# Altium schematic sheet NB-IOT.SchDoc
size A4
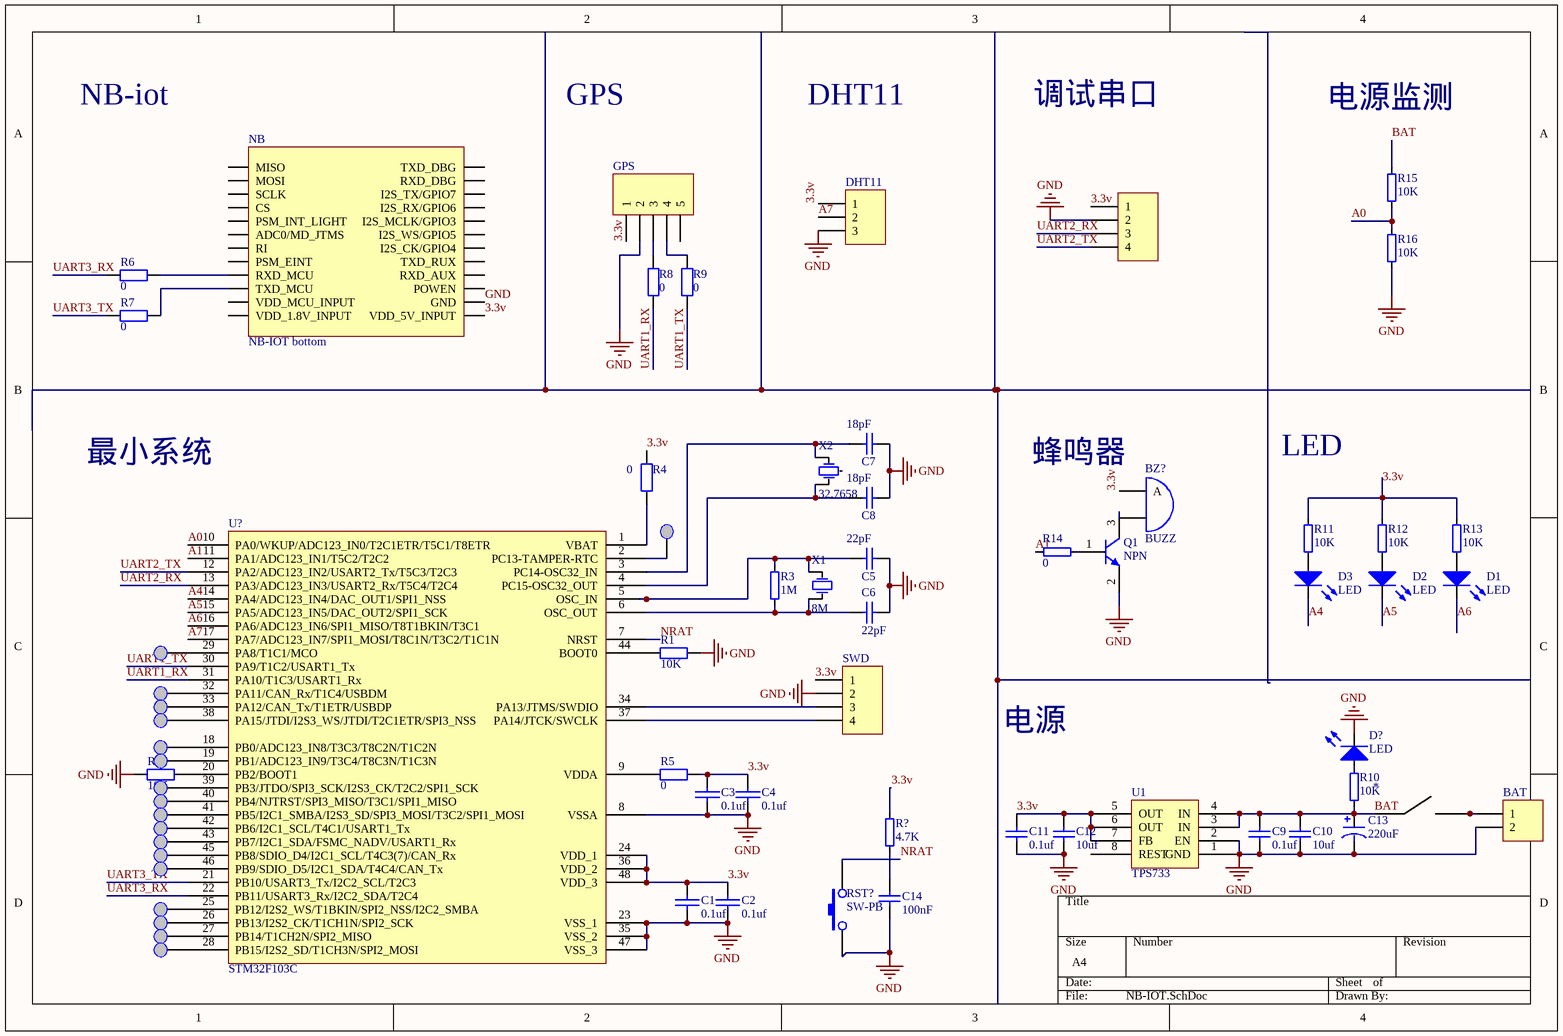
[diagram p0: NB-IOT.SchDoc]

## Parts
*  (no value)  [SMALL SW - duplicate]
A8  pin  [pin]  (value not drawn)
A11  pin  [pin]  (value not drawn)
A12  pin  [pin]  (value not drawn)
A13  pin  [pin]  (value not drawn)
B0  pin  [pin]  (value not drawn)
B1  pin  [pin]  (value not drawn)
B3  pin  [pin]  (value not drawn)
B4  pin  [pin]  (value not drawn)
B5  pin  [pin]  (value not drawn)
B6  pin  [pin]  (value not drawn)
B7  pin  [pin]  (value not drawn)
B8  pin  [pin]  (value not drawn)
B9  pin  [pin]  (value not drawn)
B12  (no value)  [pin]
B13  (no value)  [pin]
B14  (no value)  [pin]
B15  (no value)  [pin]
BAT  Header 2  [HDR1X2]  (value not drawn)
BZ?  BUZZ  [BUZZ]
C1  0.1uf  [0603(1608)]
C2  0.1uf  [0603(1608)]
C3  0.1uf  [0603(1608)]
C4  0.1uf  [0603(1608)]
C5  22pF  [0603(1608)]
C6  22pF  [0603(1608)]
C7  18pF  [0603(1608)]
C8  18pF  [0603(1608)]
C9  0.1uf  [0603(1608)]
C10  10uf  [0603(1608)]
C11  0.1uf  [0603(1608)]
C12  10uf  [0603(1608)]
C13  CAP2  [铝电解电容10*10.2]  (value not drawn)
C14  value 100nF  [C-RAD]  (hidden comment: Cap)
D1  LED  [0603LED]
D2  LED  [0603LED]
D3  LED  [0603LED]
D?  LED  [0603LED]
DHT11  Header 3  [HDR1X3]  (value not drawn)
GPS  Header 5  [HDR1X5]  (value not drawn)
NB  NB-IOT bottom  [NB-IOT bottom]
PC13  pin  [pin]  (value not drawn)
Q1  NPN  [SOT-23]
R1  value 10K  [0603(1608)]  (hidden comment: 1K)
R2  value 10K  [0603(1608)]  (hidden comment: 1K)
R3  1M  [0603(1608)]
R4  0  [0603(1608)]
R5  0  [0603(1608)]
R6  0  [0603(1608)]
R7  0  [0603(1608)]
R8  0  [0603(1608)]
R9  0  [0603(1608)]
R10  10K  [0603(1608)]
R11  10K  [0603(1608)]
R12  10K  [0603(1608)]
R13  10K  [0603(1608)]
R14  0  [0603(1608)]
R15  10K  [0603(1608)]
R16  10K  [0603(1608)]
R?  4.7K  [0603(1608)]
RST?  SW-PB  [SMT_BUTTON]
SWD  Header 4  [HDR1X4]  (value not drawn)
U1  TPS733  [SOIC-8]
U?  STM32F103C  [LQFP-48_M]
UART  Header 4  [HDR1X4]  (value not drawn)
X1  value 8M  [X-SM49]  (hidden comment: XTAL)
X2  32.7658  [X-TC15]

## Nets
GND: BAT.2 C1.2 C2.2 C3.2 C4.2 C5.1 C6.2 C7.1 C8.1 C9.1 C10.2 C11.2 C12.2 C13.2 C14.1 D?.2 DHT11.3 GPS.2 NB.14(GND) Q1.2(E) R1.2 R2.1 R16.1 RST?.1 SWD.2 U1.1(GND) U1.2(EN) U?.8(VSSA) U?.23(VSS_1) U?.35(VSS_2) U?.47(VSS_3) UART.2
3.3v: BZ?.1(A) C1.1 C2.1 C3.1 C4.1 C11.1 C12.1 DHT11.1 GPS.1 NB.13(VDD_5V_INPUT) R4.2 R5.2 R11.2 R12.2 R13.2 R?.2 SWD.1 U1.5(OUT) U1.6(OUT) U1.7(FB) U?.24(VDD_1) U?.36(VDD_2) U?.48(VDD_3) UART.1
A0: R15.1 R16.2 U?.10(PA0/WKUP/ADC123_IN0/T2C1ETR/T5C1/T8ETR)
A1: R14.2 U?.11(PA1/ADC123_IN1/T5C2/T2C2)
A4: D3.2 U?.14(PA4/ADC123_IN4/DAC_OUT1/SPI1_NSS)
A5: D2.2 U?.15(PA5/ADC123_IN5/DAC_OUT2/SPI1_SCK)
A6: D1.2 U?.16(PA6/ADC123_IN6/SPI1_MISO/T8T1BKIN/T3C1)
A7: DHT11.2 U?.17(PA7/ADC123_IN7/SPI1_MOSI/T8C1N/T3C2/T1C1N)
BAT: *.1 C9.2 C10.1 C13.1 R10.2 R15.2 U1.3(IN) U1.4(IN)
NRAT: RST?.2 U?.7(NRST)
UART1_RX: R8.1 U?.31(PA10/T1C3/USART1_Rx)
UART1_TX: R9.1 U?.30(PA9/T1C2/USART1_Tx)
UART2_RX: U?.13(PA3/ADC123_IN3/USART2_Rx/T5C4/T2C4) UART.3
UART2_TX: U?.12(PA2/ADC123_IN2/USART2_Tx/T5C3/T2C3) UART.4
UART3_RX: R6.1 U?.22(PB11/USART3_Rx/I2C2_SDA/T2C4)
UART3_TX: R7.1 U?.21(PB10/USART3_Tx/I2C2_SCL/T2C3)
Net*_2: *.2 BAT.1
NetA8_1: A8.1 U?.29(PA8/T1C1/MCO)
NetA11_1: A11.1 U?.32(PA11/CAN_Rx/T1C4/USBDM)
NetA12_1: A12.1 U?.33(PA12/CAN_Tx/T1ETR/USBDP)
NetA13_1: A13.1 U?.38(PA15/JTDI/I2S3_WS/JTDI/T2C1ETR/SPI3_NSS)
NetB0_1: B0.1 U?.18(PB0/ADC123_IN8/T3C3/T8C2N/T1C2N)
NetB1_1: B1.1 U?.19(PB1/ADC123_IN9/T3C4/T8C3N/T1C3N)
NetB3_1: B3.1 U?.39(PB3/JTDO/SPI3_SCK/I2S3_CK/T2C2/SPI1_SCK)
NetB4_1: B4.1 U?.40(PB4/NJTRST/SPI3_MISO/T3C1/SPI1_MISO)
NetB5_1: B5.1 U?.41(PB5/I2C1_SMBA/I2S3_SD/SPI3_MOSI/T3C2/SPI1_MOSI)
NetB6_1: B6.1 U?.42(PB6/I2C1_SCL/T4C1/USART1_Tx)
NetB7_1: B7.1 U?.43(PB7/I2C1_SDA/FSMC_NADV/USART1_Rx)
NetB8_1: B8.1 U?.45(PB8/SDIO_D4/I2C1_SCL/T4C3(7)/CAN_Rx)
NetB9_1: B9.1 U?.46(PB9/SDIO_D5/I2C1_SDA/T4C4/CAN_Tx)
NetB12_1: B12.1 U?.25(PB12/I2S2_WS/T1BKIN/SPI2_NSS/I2C2_SMBA)
NetB13_1: B13.1 U?.26(PB13/I2S2_CK/T1CH1N/SPI2_SCK)
NetB14_1: B14.1 U?.27(PB14/T1CH2N/SPI2_MISO)
NetB15_1: B15.1 U?.28(PB15/I2S2_SD/T1CH3N/SPI2_MOSI)
NetBZ?_2: BZ?.2(B) Q1.3(C)
NetC5_2: C5.2 R3.2 U?.5(OSC_IN) X1.1(OSC1)
NetC6_1: C6.1 R3.1 U?.6(OSC_OUT) X1.2(OSC2)
NetC7_2: C7.2 U?.3(PC14-OSC32_IN) X2.2(OSC2)
NetC8_2: C8.2 U?.4(PC15-OSC32_OUT) X2.1(OSC1)
NetC14_2: C14.2 R?.1
NetD1_1: D1.1 R13.1
NetD2_1: D2.1 R12.1
NetD3_1: D3.1 R11.1
NetD?_1: D?.1 R10.1
NetGPS_3: GPS.3 R8.2
NetGPS_4: GPS.4 R9.2
NetNB_9: NB.9(RXD_MCU) R6.2
NetNB_10: NB.10(TXD_MCU) R7.2
NetPC13_1: PC13.1 U?.2(PC13-TAMPER-RTC)
NetQ1_1: Q1.1(B) R14.1
NetR1_1: R1.1 U?.44(BOOT0)
NetR2_2: R2.2 U?.20(PB2/BOOT1)
NetR4_1: R4.1 U?.1(VBAT)
NetR5_1: R5.1 U?.9(VDDA)
NetSWD_3: SWD.3 U?.34(PA13/JTMS/SWDIO)
NetSWD_4: SWD.4 U?.37(PA14/JTCK/SWCLK)

Not connected (* = marked no-connect by the designer): GPS 5; NB 1(MISO) 2(MOSI) 3(SCLK) 4(CS) 5(PSM_INT_LIGHT) 6(ADC0/MD_JTMS) 7(RI) 8(PSM_EINT) 11(VDD_MCU_INPUT) 12(VDD_1.8V_INPUT) 15(POWEN) 16(RXD_AUX) 17(TXD_RUX) 18(I2S_CK/GPIO4) 19(I2S_WS/GPIO5) 20(I2S_MCLK/GPIO3) 21(I2S_RX/GPIO6) 22(I2S_TX/GPIO7) 23(RXD_DBG) 24(TXD_DBG); U1 8(REST); X2 3

## Notes on the sheet
- NB-iot
- GPS
- DHT11
- 调试串口
- 电源监测
- 最小系统
- 蜂鸣器
- LED
- 电源
- (in symbol CAP2) 220uF

## Library data of the parts
* = small sw
B12-B15 = pin
BAT = Header 2: Header, 2-Pin; LatestRevisionDate: 17-Jul-2002; LatestRevisionNote: Re-released for DXP Platform.; Publisher: Altium Limited
C1-C4 = 普通电容: Capacitor
C5-C12 = Cap_1: Capacitor; Value: 100nF; Published: 8-Jun-2000; LatestRevisionDate: 17-Jul-2002; LatestRevisionNote: Re-released for DXP Platform.; PackageReference: RAD-0.3; Publisher: Altium Limited; PackageDescription: Radial Cap, Thru-Hole; 2 Leads; 0.3 in Pin Spacing
C13 = CAP2: 电容带极性
C14 = Cap: 无极性电容; Published: 8-Jun-2000; LatestRevisionDate: 17-Jul-2002; LatestRevisionNote: Re-released for DXP Platform.; PackageReference: RAD-0.3; Publisher: Altium Limited
D1-D3 D? = LED_1
DHT11 = Header 3: Header, 3-Pin; LatestRevisionDate: 17-Jul-2002; LatestRevisionNote: Re-released for DXP Platform.; Publisher: Altium Limited
GPS = Header 5: GPS; LatestRevisionDate: 17-Jul-2002; LatestRevisionNote: Re-released for DXP Platform.; Publisher: Altium Limited
Q1 = SS8050: NPN贴片三极管; Published: 8-Jun-2000; LatestRevisionDate: 15-Jan-2003; LatestRevisionNote: PCB Footprint 'BCY-W3/D4.7' replaced; DatasheetDocument: 1997; PackageDocument: Sep-1998; PackageReference: TO-92A; Publisher: Altium Limited; Code_JEDEC: TO-92A; ComponentLink1Description: Manufacturer Link; ComponentLink1URL: http://www.fairchildsemi.com/; ComponentLink2Description: Datasheet; ComponentLink2URL: http://www.fairchildsemi.com/ds/2N%2F2N3904.pdf
R1 R2 = Res2_1: Resistor; Published: 8-Jun-2000; LatestRevisionDate: 17-Jul-2002; LatestRevisionNote: Re-released for DXP Platform.; PackageReference: AXIAL-0.4; Publisher: Altium Limited; PackageDescription: Axial Device, Thru-Hole; 2 Leads; 0.4 in Pin Spacing
R3 R10-R16 R? = RES
R4-R9 = Res2_1: Resistor; Value: 10K; Published: 8-Jun-2000; LatestRevisionDate: 17-Jul-2002; LatestRevisionNote: Re-released for DXP Platform.; PackageReference: AXIAL-0.4; Publisher: Altium Limited; PackageDescription: Axial Device, Thru-Hole; 2 Leads; 0.4 in Pin Spacing
RST? = 微动开关
SWD UART = Header 4: Header, 4-Pin; LatestRevisionDate: 17-Jul-2002; LatestRevisionNote: Re-released for DXP Platform.; Publisher: Altium Limited
U1 = TPS
U? = STM32F103C: STM32单片机48引脚
X1 = XTAL: 晶振; Published: 8-Jun-2000; LatestRevisionDate: 17-Jul-2002; LatestRevisionNote: Re-released for DXP Platform.; PackageReference: R38; Publisher: Altium Limited
X2 = XTAL_SM: 圆柱晶振; Value: 8M; Published: 8-Jun-2000; LatestRevisionDate: 17-Jul-2002; LatestRevisionNote: Re-released for DXP Platform.; PackageReference: R38; Publisher: Altium Limited